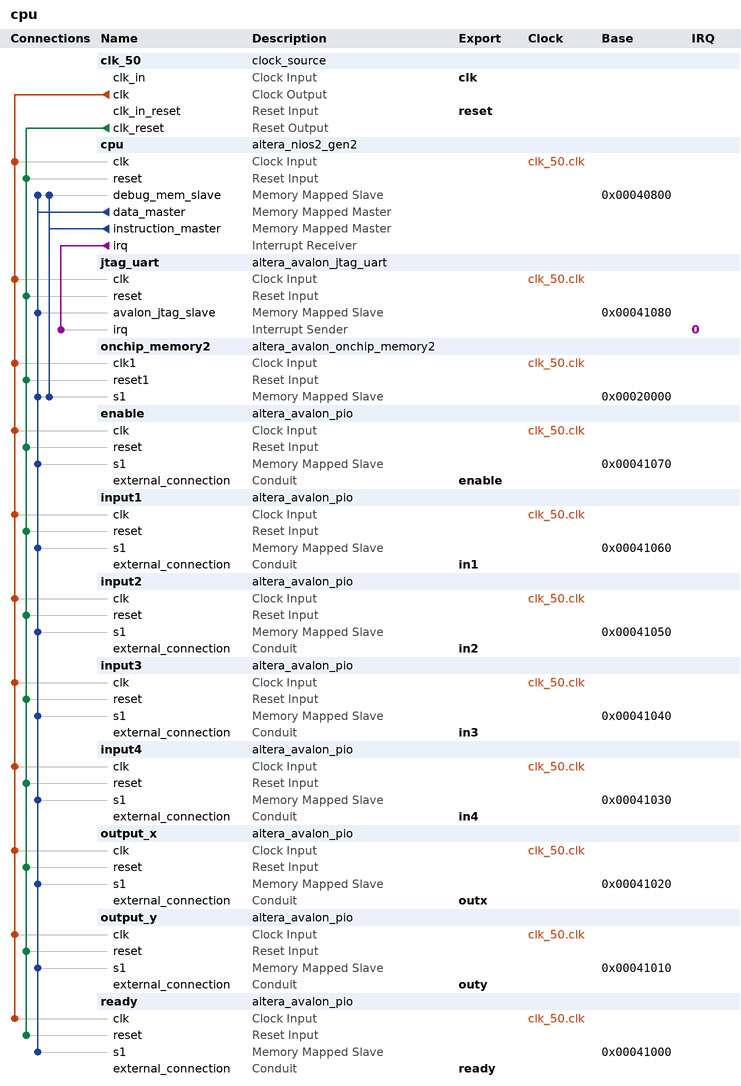
[diagram p0: system contents]
# Platform Designer (Qsys) system cpu, Cyclone V 5CSEMA5F31C6
# Parameters at their usual value, and those the tool derives, are not listed.
package require -exact qsys 18.0
create_system cpu
set_project_property DEVICE_FAMILY {Cyclone V}
set_project_property DEVICE 5CSEMA5F31C6

add_instance clk_50 clock_source 18.0
set_instance_parameter_value clk_50 clockFrequency 50000000

add_instance cpu altera_nios2_gen2 18.0
set_instance_parameter_value cpu dcache_size 2048
set_instance_parameter_value cpu exceptionSlave onchip_memory2.s1
set_instance_parameter_value cpu icache_size 4096
set_instance_parameter_value cpu impl Tiny
set_instance_parameter_value cpu resetSlave onchip_memory2.s1

add_instance jtag_uart altera_avalon_jtag_uart 18.0
set_instance_parameter_value jtag_uart simInteractiveOptions NO_INTERACTIVE_WINDOWS

add_instance onchip_memory2 altera_avalon_onchip_memory2 18.0
set_instance_parameter_value onchip_memory2 dataWidth 32
set_instance_parameter_value onchip_memory2 dualPort false
set_instance_parameter_value onchip_memory2 initMemContent false
set_instance_parameter_value onchip_memory2 initializationFileName onchip_mem.hex
set_instance_parameter_value onchip_memory2 memorySize 102400

add_instance enable altera_avalon_pio 18.0
set_instance_parameter_value enable direction Input
set_instance_parameter_value enable width 1

add_instance input1 altera_avalon_pio 18.0
set_instance_parameter_value input1 direction Input
set_instance_parameter_value input1 width 32

add_instance input2 altera_avalon_pio 18.0
set_instance_parameter_value input2 direction Input
set_instance_parameter_value input2 width 32

add_instance input3 altera_avalon_pio 18.0
set_instance_parameter_value input3 direction Input
set_instance_parameter_value input3 width 32

add_instance input4 altera_avalon_pio 18.0
set_instance_parameter_value input4 direction Input
set_instance_parameter_value input4 width 32

add_instance output_x altera_avalon_pio 18.0
set_instance_parameter_value output_x direction Output
set_instance_parameter_value output_x width 3

add_instance output_y altera_avalon_pio 18.0
set_instance_parameter_value output_y direction Output
set_instance_parameter_value output_y width 3

add_instance ready altera_avalon_pio 18.0
set_instance_parameter_value ready direction Output
set_instance_parameter_value ready width 1

# connections
add_connection clk_50.clk cpu.clk clock
add_connection clk_50.clk enable.clk clock
add_connection clk_50.clk input1.clk clock
add_connection clk_50.clk input2.clk clock
add_connection clk_50.clk input3.clk clock
add_connection clk_50.clk input4.clk clock
add_connection clk_50.clk jtag_uart.clk clock
add_connection clk_50.clk onchip_memory2.clk1 clock
add_connection clk_50.clk output_x.clk clock
add_connection clk_50.clk output_y.clk clock
add_connection clk_50.clk ready.clk clock
add_connection clk_50.clk_reset cpu.reset reset
add_connection clk_50.clk_reset enable.reset reset
add_connection clk_50.clk_reset input1.reset reset
add_connection clk_50.clk_reset input2.reset reset
add_connection clk_50.clk_reset input3.reset reset
add_connection clk_50.clk_reset input4.reset reset
add_connection clk_50.clk_reset jtag_uart.reset reset
add_connection clk_50.clk_reset onchip_memory2.reset1 reset
add_connection clk_50.clk_reset output_x.reset reset
add_connection clk_50.clk_reset output_y.reset reset
add_connection clk_50.clk_reset ready.reset reset
add_connection cpu.data_master cpu.debug_mem_slave avalon
set_connection_parameter_value cpu.data_master/cpu.debug_mem_slave baseAddress 0x00040800
add_connection cpu.data_master enable.s1 avalon
set_connection_parameter_value cpu.data_master/enable.s1 baseAddress 0x00041070
add_connection cpu.data_master input1.s1 avalon
set_connection_parameter_value cpu.data_master/input1.s1 baseAddress 0x00041060
add_connection cpu.data_master input2.s1 avalon
set_connection_parameter_value cpu.data_master/input2.s1 baseAddress 0x00041050
add_connection cpu.data_master input3.s1 avalon
set_connection_parameter_value cpu.data_master/input3.s1 baseAddress 0x00041040
add_connection cpu.data_master input4.s1 avalon
set_connection_parameter_value cpu.data_master/input4.s1 baseAddress 0x00041030
add_connection cpu.data_master jtag_uart.avalon_jtag_slave avalon
set_connection_parameter_value cpu.data_master/jtag_uart.avalon_jtag_slave baseAddress 0x00041080
add_connection cpu.data_master onchip_memory2.s1 avalon
set_connection_parameter_value cpu.data_master/onchip_memory2.s1 baseAddress 0x00020000
add_connection cpu.data_master output_x.s1 avalon
set_connection_parameter_value cpu.data_master/output_x.s1 baseAddress 0x00041020
add_connection cpu.data_master output_y.s1 avalon
set_connection_parameter_value cpu.data_master/output_y.s1 baseAddress 0x00041010
add_connection cpu.data_master ready.s1 avalon
set_connection_parameter_value cpu.data_master/ready.s1 baseAddress 0x00041000
add_connection cpu.instruction_master cpu.debug_mem_slave avalon
set_connection_parameter_value cpu.instruction_master/cpu.debug_mem_slave baseAddress 0x00040800
add_connection cpu.instruction_master onchip_memory2.s1 avalon
set_connection_parameter_value cpu.instruction_master/onchip_memory2.s1 baseAddress 0x00020000
add_connection cpu.irq jtag_uart.irq interrupt
set_connection_parameter_value cpu.irq/jtag_uart.irq irqNumber 0

# exported interfaces
add_interface clk clock sink
set_interface_property clk EXPORT_OF clk_50.clk_in
add_interface enable conduit end
set_interface_property enable EXPORT_OF enable.external_connection
add_interface in1 conduit end
set_interface_property in1 EXPORT_OF input1.external_connection
add_interface in2 conduit end
set_interface_property in2 EXPORT_OF input2.external_connection
add_interface in3 conduit end
set_interface_property in3 EXPORT_OF input3.external_connection
add_interface in4 conduit end
set_interface_property in4 EXPORT_OF input4.external_connection
add_interface outx conduit end
set_interface_property outx EXPORT_OF output_x.external_connection
add_interface outy conduit end
set_interface_property outy EXPORT_OF output_y.external_connection
add_interface ready conduit end
set_interface_property ready EXPORT_OF ready.external_connection
add_interface reset reset sink
set_interface_property reset EXPORT_OF clk_50.clk_in_reset

set_interconnect_requirement {$system} qsys_mm.clockCrossingAdapter HANDSHAKE
set_interconnect_requirement {$system} qsys_mm.enableEccProtection FALSE
set_interconnect_requirement {$system} qsys_mm.insertDefaultSlave FALSE
set_interconnect_requirement {$system} qsys_mm.maxAdditionalLatency 1

save_system cpu.qsys
